# EAGLE design ir_rw_head (EAGLE 9.5.2)
CNAME: https://github.com/thomo/smartmeter; CREVISION: v1.0; DESIGNER: ThoMo
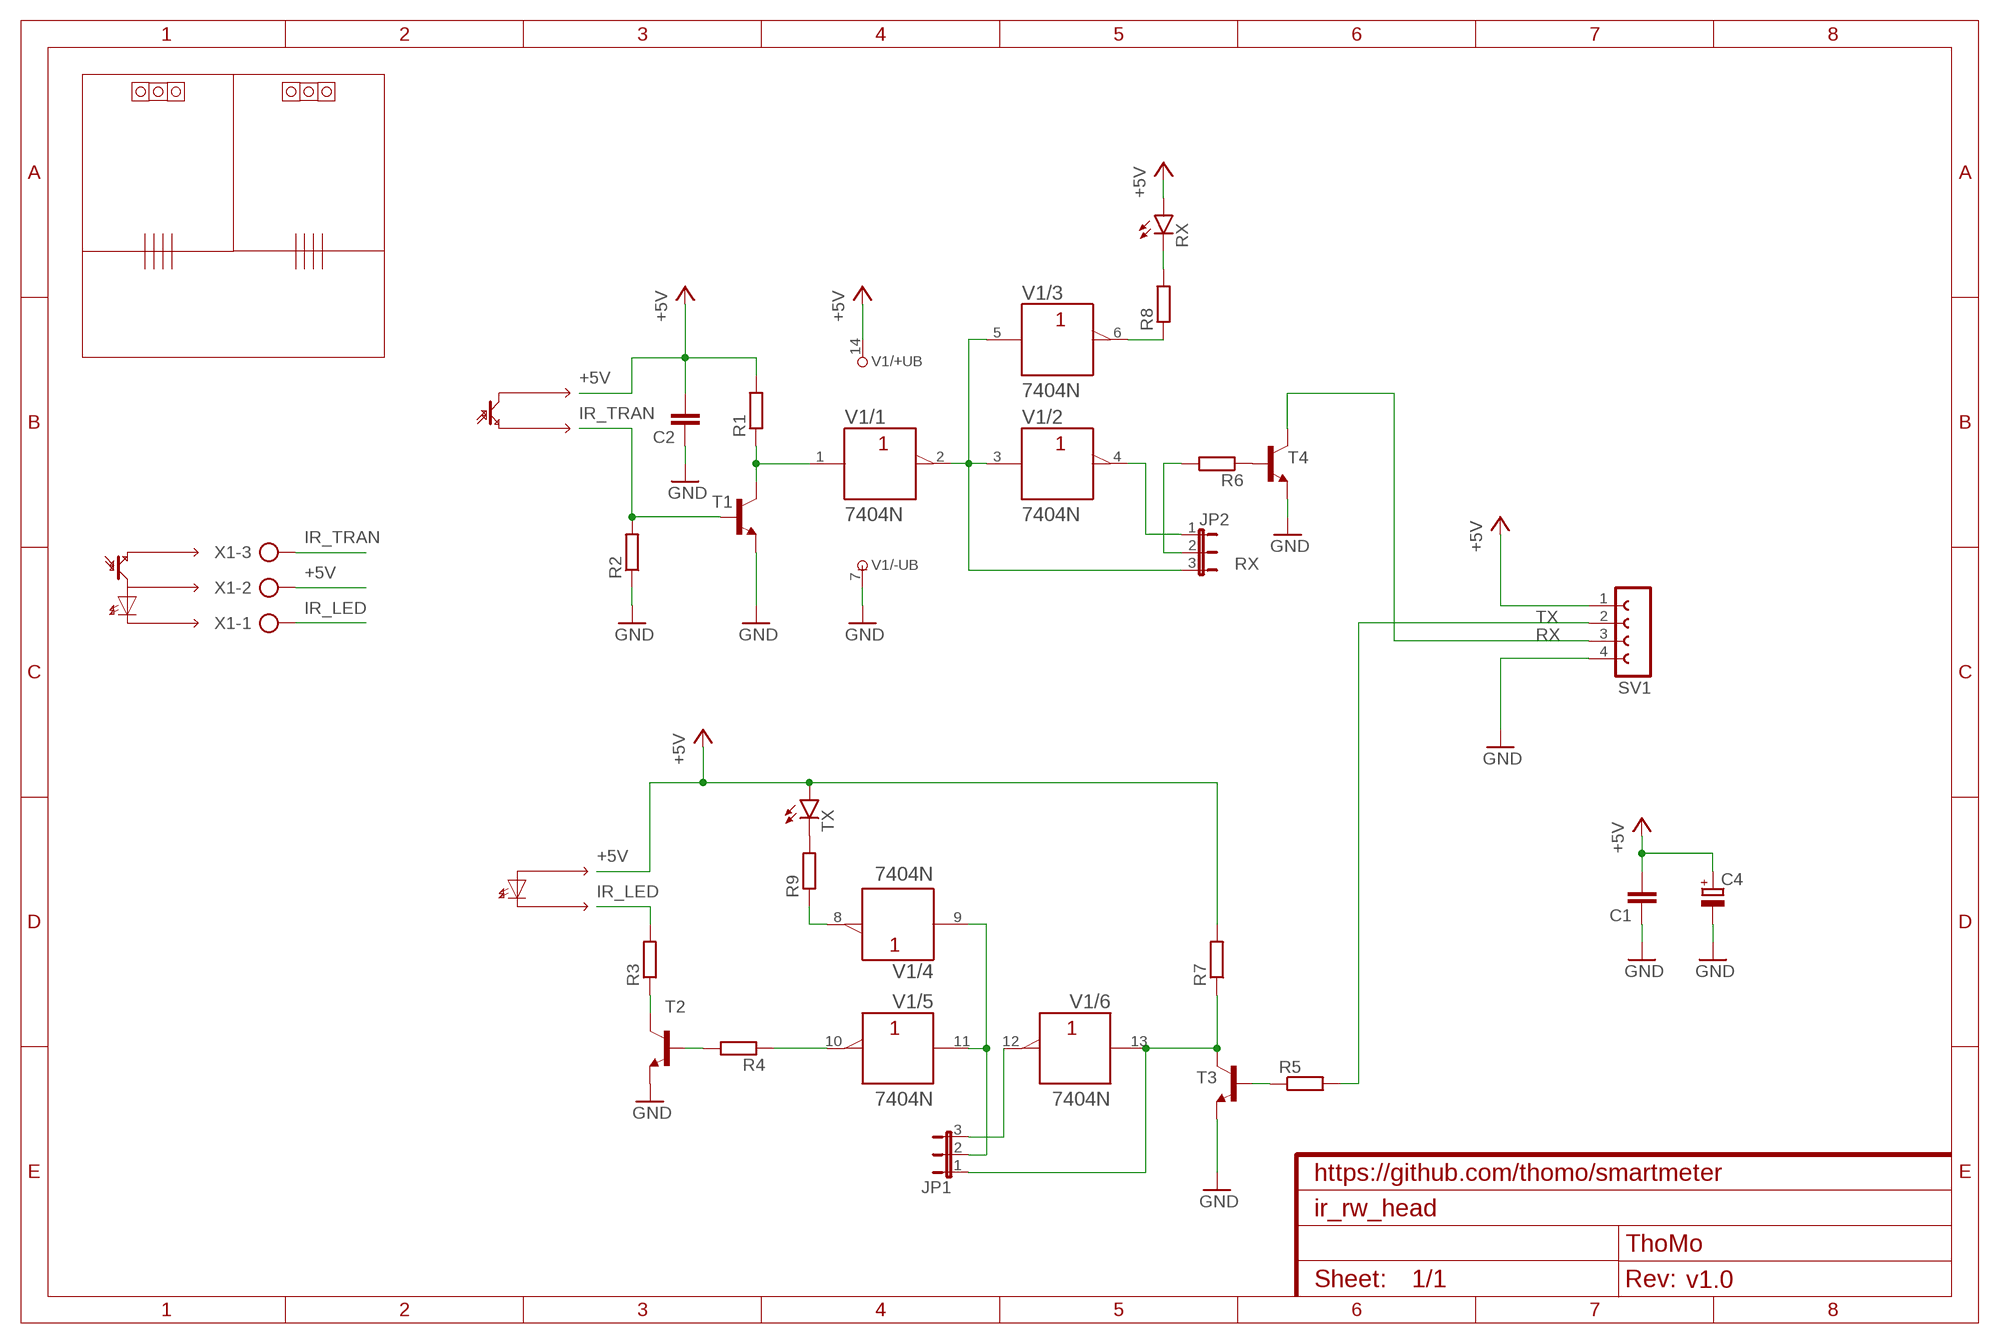
[diagram p0: schematic, sheet 1]

## Parts
C1  C-EU050-030X075  [C050-030X075]
C2  C-EU050-030X075  [C050-030X075]
C4  CPOL-EUE2.5-7  [E2,5-7]
JP1  JP2E  [JP2]
JP2  JP2E  [JP2]
R1  R-EU_0207/10  [0207/10]
R2  R-EU_0207/10  [0207/10]
R3  R-EU_0207/10  [0207/10]
R4  R-EU_0207/10  [0207/10]
R5  R-EU_0207/10  [0207/10]
R6  R-EU_0207/10  [0207/10]
R7  R-EU_0207/10  [0207/10]
R8  R-EU_0207/10  [0207/10]
R9  R-EU_0207/10  [0207/10]
RX  LED5MM  [LED5MM]
SV1  FE04-1W  [FE04-1W]
T1  -NPN-TO92-EBC  [TO92-EBC]
T2  -NPN-TO92-EBC  [TO92-EBC]
T3  -NPN-TO92-EBC  [TO92-EBC]
T4  -NPN-TO92-EBC  [TO92-EBC]
TX  LED5MM  [LED5MM]
V1  7404N  [DIL14]
X1  AK500/3  [AK500/3]

## Nets
+5V: C1.2 C2.2 C4.+ R1.2 R7.2 RX.A SV1.1 TX.A V1.14(/+UB:+UB) X1.2
GND: C1.1 C2.1 C4.- R2.1 SV1.4 T1.E T2.E T3.E T4.E V1.7(/-UB:-UB)
IR_LED: R3.2 X1.1
IR_TRAN: R2.2 T1.B X1.3
N$1: R4.2 T2.B
N$2: R3.1 T2.C
N$3: R4.1 V1.10(/5:Y)
N$4: JP1.1 R7.1 T3.C V1.13(/6:A)
N$6: R5.1 T3.B
N$8: R8.2 RX.K(C)
N$9: R1.1 T1.C V1.1(/1:A)
N$10: JP2.3 V1.2(/1:Y) V1.3(/2:A) V1.5(/3:A)
N$11: R9.2 TX.K(C)
N$12: R6.1 T4.B
N$13: JP2.2 R6.2
N$14: JP2.1 V1.4(/2:Y)
N$15: R8.1 V1.6(/3:Y)
N$16: R9.1 V1.8(/4:Y)
N$17: JP1.3 V1.12(/6:Y)
RX: SV1.3 T4.C
TX: R5.2 SV1.2
TX_L: JP1.2 V1.9(/4:A) V1.11(/5:A)

## Library data of the parts
C1 C2 = rcl:C-EU: CAPACITOR, European symbol; SPICEPREFIX: C
C4 = rcl:CPOL-EU: POLARIZED CAPACITOR, European symbol; SPICEPREFIX: C
JP1 JP2 = jumper:JP2E: JUMPER
R1-R9 = rcl:R-EU_: RESISTOR, European symbol; SPICEPREFIX: R
RX TX = led:LED: LED OSRAM: - CHIPLED LG R971, LG N971, LY N971, LG Q971, LY Q971, LO R971, LY R971 LH N974, LH R974 LS Q976, LO Q976, LY Q976 LO Q996 - Hyper CHIPLED LW Q18S LB Q993, LB Q99A, LB R99A - SideLED LS A670, LO A670, LY A670, LG A670, LP A670 LB A673, LV A673, LT A673, LW A673 LH A674 LY A675 LS A676, LA A676, LO A676, LY A676, LW A676 LS A679, LY A679, LG A679 - Hyper Micro SIDELED® LS Y876, LA Y876, LO Y876, LY Y876 LT Y87S - SmartLED LW L88C, LW L88S LB L89C, LB L89S, LG L890 LS L89K, LO L89K, LY L89K LS L896, LA L896, LO L896, LY L896 - TOPLED LS T670, LO T670, LY T670, LG T670, LP T670 LSG T670, LSP T670, LSY T670, LOP T670, LYG T670 LG T671, LOG T671, LSG T671 LB T673, LV T673, LT T673, LW T673 LH T674 LS T676, LA T676, LO T676, LY T676, LB T676, LH T676, LSB T676, LW T676 LB T67C, LV T67C, LT T67C, LS T67K, LO T67K, LY T67K, LW E67C LS E67B, LA E67B, LO E67B, LY E67B, LB E67C, LV E67C, LT E67C LW T67C LS T679, LY T679, LG T679 LS T770, LO T770, LY T770, LG T770, LP T770 LB T773, LV T773, LT T773, LW T773 LH T774 LS E675, LA E675, LY E675, LS T675 LS T776, LA T776, LO T776, LY T776, LB T776 LHGB T686 LT T68C, LB T68C - Hyper Mini TOPLED® LB M676 - Mini TOPLED Santana® LG M470 LS M47K, LO M47K, LY M47K Source: http://www.osram.convergy.de LUXEON: - LUMILED® LXK2-PW12-R00, LXK2-PW12-S00, LXK2-PW14-U00, LXK2-PW14-V00 LXK2-PM12-R00, LXK2-PM12-S00, LXK2-PM14-U00 LXK2-PE12-Q00, LXK2-PE12-R00, LXK2-PE12-S00, LXK2-PE14-T00, LXK2-PE14-U00 LXK2-PB12-K00, LXK2-PB12-L00, LXK2-PB12-M00, LXK2-PB14-N00, LXK2-PB14-P00, LXK2-PB14-Q00 LXK2-PR12-L00, LXK2-PR12-M00, LXK2-PR14-Q00, LXK2-PR14-R00 LXK2-PD12-Q00, LXK2-PD12-R00, LXK2-PD12-S00 LXK2-PH12-R00, LXK2-PH12-S00 LXK2-PL12-P00, LXK2-PL12-Q00, LXK2-PL12-R00 Source: www.luxeon.com KINGBRIGHT: KA-3528ASYC Source: www.kingbright.com
SV1 = thomo:FE04-1W: FEMALE HEADER; OC_FARNELL: unknown; OC_NEWARK: unknown
T1-T4 = transistor:*-NPN-: NPN Transistror BF959 corrected 2008.03.06
V1 = 74ttl-din:74*04: Hex INVERTER
X1 = con-ptr500:AK500/3: CONNECTOR; OC_FARNELL: unknown; OC_NEWARK: unknown

## Board
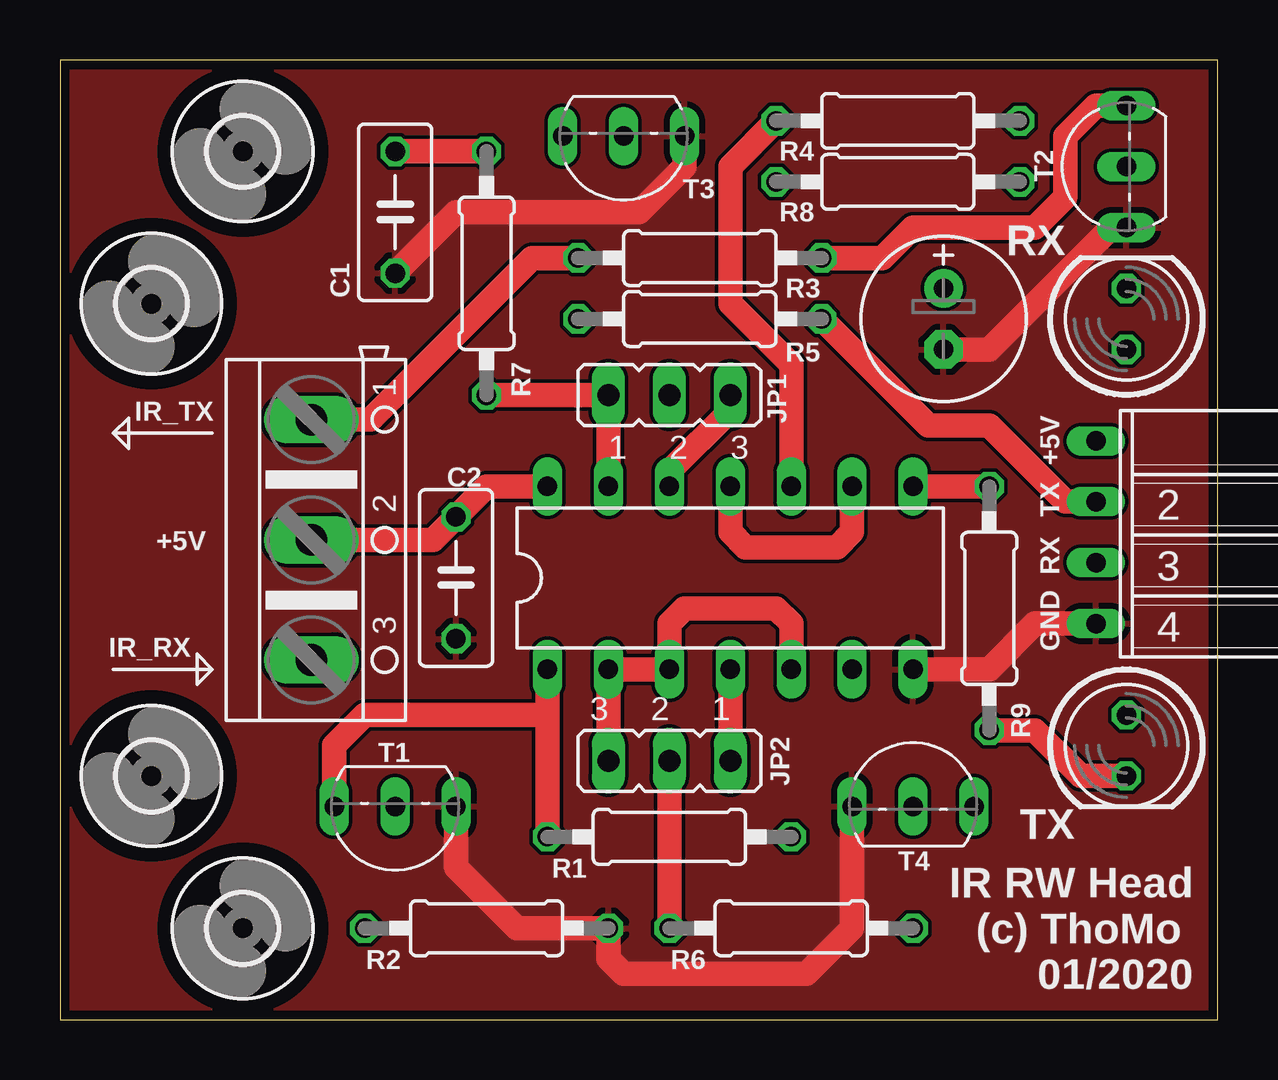
[diagram p1: board, top side]
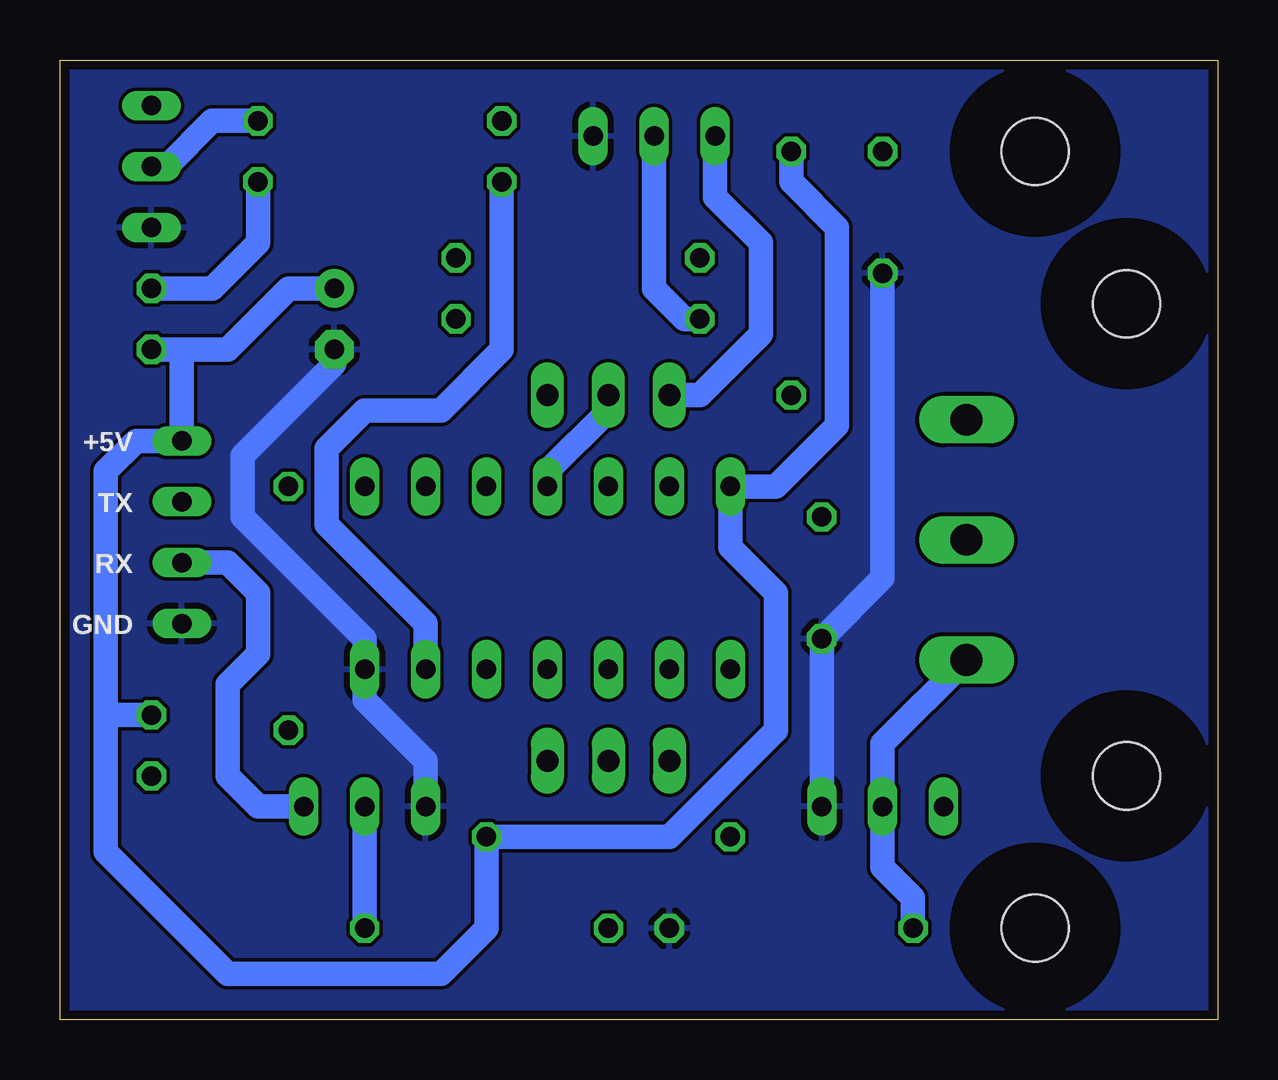
[diagram p2: board, bottom side, seen from below]

Size 48.26 x 40.01 mm. Coordinates in mm from the lower left corner, seen from the top.
Outline: 0,0 48.26,0 48.26,40.01 0,40.01 0,0
Copper layers (1*16): Top 0.035559375mm / dielectric 1.6mm / Bottom 0.035559375mm
Design rules "oshpark-2layer-tented": minimum track width 6mil, minimum drill 10mil, track to track 6mil, track to pad 6mil, pad to pad 6mil, via to via 6mil, smd to smd 6mil, copper to edge 15mil, drill to drill 6mil, minimum pad ring 5mil, minimum via ring 5mil, stop-mask expansion 2.5mil, vias tented up to drill 20mil, thermal gap 10mil

### Footprints (pad centres in the part's own frame; a part is rotated, then mirrored left to right if it is on the bottom)
C050-030X075 = drill 0.813 octagon: 1 -2.54,0; 2 2.54,0
E2,5-7 = drill 0.813 pad 1.6: + -1.27,0 | drill 0.813 pad 1.6 octagon: - 1.27,0
JP2 = drill 0.914 long: 1 -2.54,0; 2 0,0; 3 2.54,0
0207/10 = drill 0.813 octagon: 1 -5.08,0; 2 5.08,0
LED5MM = drill 0.813 octagon: A -1.27,0; K 1.27,0
FE04-1W = drill 0.813 long: 1 -5.08,0; 2 -2.54,0; 3 0,0; 4 2.54,0
TO92-EBC = drill 0.813 long: B 0,-1.27; C 2.54,-1.27; E -2.54,-1.27
2,8 = hole 2.8: 0,0
DIL14 = drill 0.813 long: 1 -7.62,-3.81; 2 -5.08,-3.81; 3 -2.54,-3.81; 4 0,-3.81; 5 2.54,-3.81; 6 5.08,-3.81; 7 7.62,-3.81; 8 7.62,3.81; 9 5.08,3.81; 10 2.54,3.81; 11 0,3.81; 12 -2.54,3.81; 13 -5.08,3.81; 14 -7.62,3.81
AK500/3 = drill 1.321 long: 1 -5.004,0; 2 0,0; 3 5.004,0

### Placement (x,y rotation side)
C1  13.97,33.66 90 top
C2  16.51,18.41 90 top
C4  36.83,29.21 270 top
JP1  25.4,26.04 0 top
JP2  25.4,10.79 180 top
R1  25.4,7.62 0 top
R2  17.78,3.81 180 top
R3  26.67,31.75 180 top
R4  34.92,37.47 0 top
R5  26.67,29.21 0 top
R6  30.48,3.81 180 top
R7  17.78,31.11 90 top
R8  34.92,34.92 0 top
R9  38.73,17.14 270 top
RX  44.45,29.21 90 top
SV1  43.18,19.05 270 top
T1  13.97,7.62 180 top
T2  43.18,35.56 90 top
T3  23.5,35.56 180 top
T4  35.56,10.16 0 top
TX  44.45,11.43 270 top
U$1  [2,8]  7.62,3.81 0 top
U$2  [2,8]  3.81,29.84 0 top
U$3  [2,8]  3.81,10.16 0 top
U$4  [2,8]  7.62,36.2 0 top
V1  27.94,18.41 0 top
X1  10.48,20 270 top

### Tracks (layer width: path | path; a pad name or v marks a point on that pad's centre or on a via)
+5V
  Top 1.016: R7.2 C1.2 | V1.14 17.78,22.23 C2.2 15.56,20 X1.2
  Bottom 1.016: R7.2 17.78,34.92 15.88,33.02 15.88,24.77 18.41,22.23 V1.14 20.32,19.68 18.41,17.78 18.41,12.06 22.86,7.62 R1.2 30.48,3.81 32.38,1.91 41.27,1.91 46.35,6.99 46.35,12.7 | 46.35,12.7 46.35,22.86 45.09,24.13 SV1.1 43.18,27.94 RX.A 41.27,27.94 38.73,30.48 C4.+ | TX.A 46.35,12.7
GND
  Top 1.016: V1.7 38.73,14.61 40.64,16.51 SV1.4 | T1.E 16.51,6.35 19.05,3.81 R2.1 22.86,2.54 23.5,1.91 31.11,1.91 33.02,3.81 T4.E | T3.E 26.04,35.56 24.13,33.66 16.51,33.66 C1.1 | C4.- 38.73,27.94 43.81,33.02 T2.E
  Bottom 1.016: T4.E 33.02,10.79 35.56,13.34 V1.7 35.56,15.88 40.64,20.95 40.64,23.52 36.83,27.33 C4.- | T1.E C2.1 13.97,18.41 C1.1
  pour Top: 0,0 0,40.01 48.26,40.01 48.26,0
  pour Bottom: 0,0 0,40.01 48.26,40.01 48.26,0
IR_LED
  Top 1.016: R3.2 19.68,31.75 12.94,25.01 X1.1
IR_TRAN
  Bottom 1.016: R2.2 12.7,5.08 13.97,6.35 T1.B 13.97,11.51 X1.3
N$1
  Bottom 1.016: R4.2 41.91,37.47 43.81,35.56 T2.B
N$2
  Top 1.016: R3.1 34.29,31.75 35.56,33.02 40.64,33.02 41.91,34.29 41.91,36.83 43.18,38.1 T2.C
N$3
  Top 1.016: V1.10 30.48,27.3 27.94,29.84 27.94,35.56 R4.1
N$4
  Top 1.016: R7.1 JP1.1 V1.13
  Bottom 1.016: T3.C 20.95,34.29 19.05,32.38 19.05,28.57 21.59,26.04 JP1.1
N$6
  Bottom 1.016: T3.B 23.5,30.48 22.23,29.21 R5.1
N$8
  Bottom 1.016: R8.2 40.01,32.38 41.91,30.48 RX.K
N$9
  Top 1.016: T1.C 11.43,11.43 12.7,12.7 20.32,12.7 V1.1 R1.1
N$10
  Top 1.016: V1.5 30.48,16.51 29.84,17.14 26.04,17.14 25.4,16.51 V1.3 V1.2 JP2.3
N$11
  Top 1.016: R9.2 40.64,12.06 42.55,10.16 TX.K
N$12
  Bottom 1.016: T4.B R6.1
N$13
  Top 1.016: JP2.2 R6.2
N$14
  Top 1.016: JP2.1 V1.4
N$15
  Bottom 1.016: V1.6 33.02,16.51 37.15,20.64 37.15,23.81 35.56,25.4 32.38,25.4 29.84,27.94 R8.1
N$16
  Top 1.016: R9.1 V1.8
N$17
  Top 1.016: V1.12 25.4,22.86 27.94,25.4 JP1.3
RX
  Bottom 1.016: SV1.3 41.27,19.05 40.01,17.78 40.01,15.24 41.27,13.97 41.27,10.16 40.01,8.89 T4.C
TX
  Top 1.016: R5.2 36.2,24.77 38.73,24.77 41.91,21.59 SV1.2
TX_L
  Top 1.016: V1.9 33.02,20.32 32.38,19.68 28.57,19.68 27.94,20.32 V1.11
  Bottom 1.016: V1.11 27.94,22.86 25.4,25.4 JP1.2

### Text on the board
tPlace: IR_TX | +5V | TX | +5V | RX | IR_RX | GND | IR RW Head / (c) ThoMo / 01/2020
bPlace: +5V | TX | RX | GND